# EasyEDA Pro project PCB工程源文件-RY-Serial.epro

# Schematic Schematic1
Create Date: 2024-03-03; Page Name: P1; Project Name: USB2Serial V1.0; Schematic Name: Schematic1; Update Date: 2024-03-04; Company: RYMCU; Page Size: A4; Version: V1.2
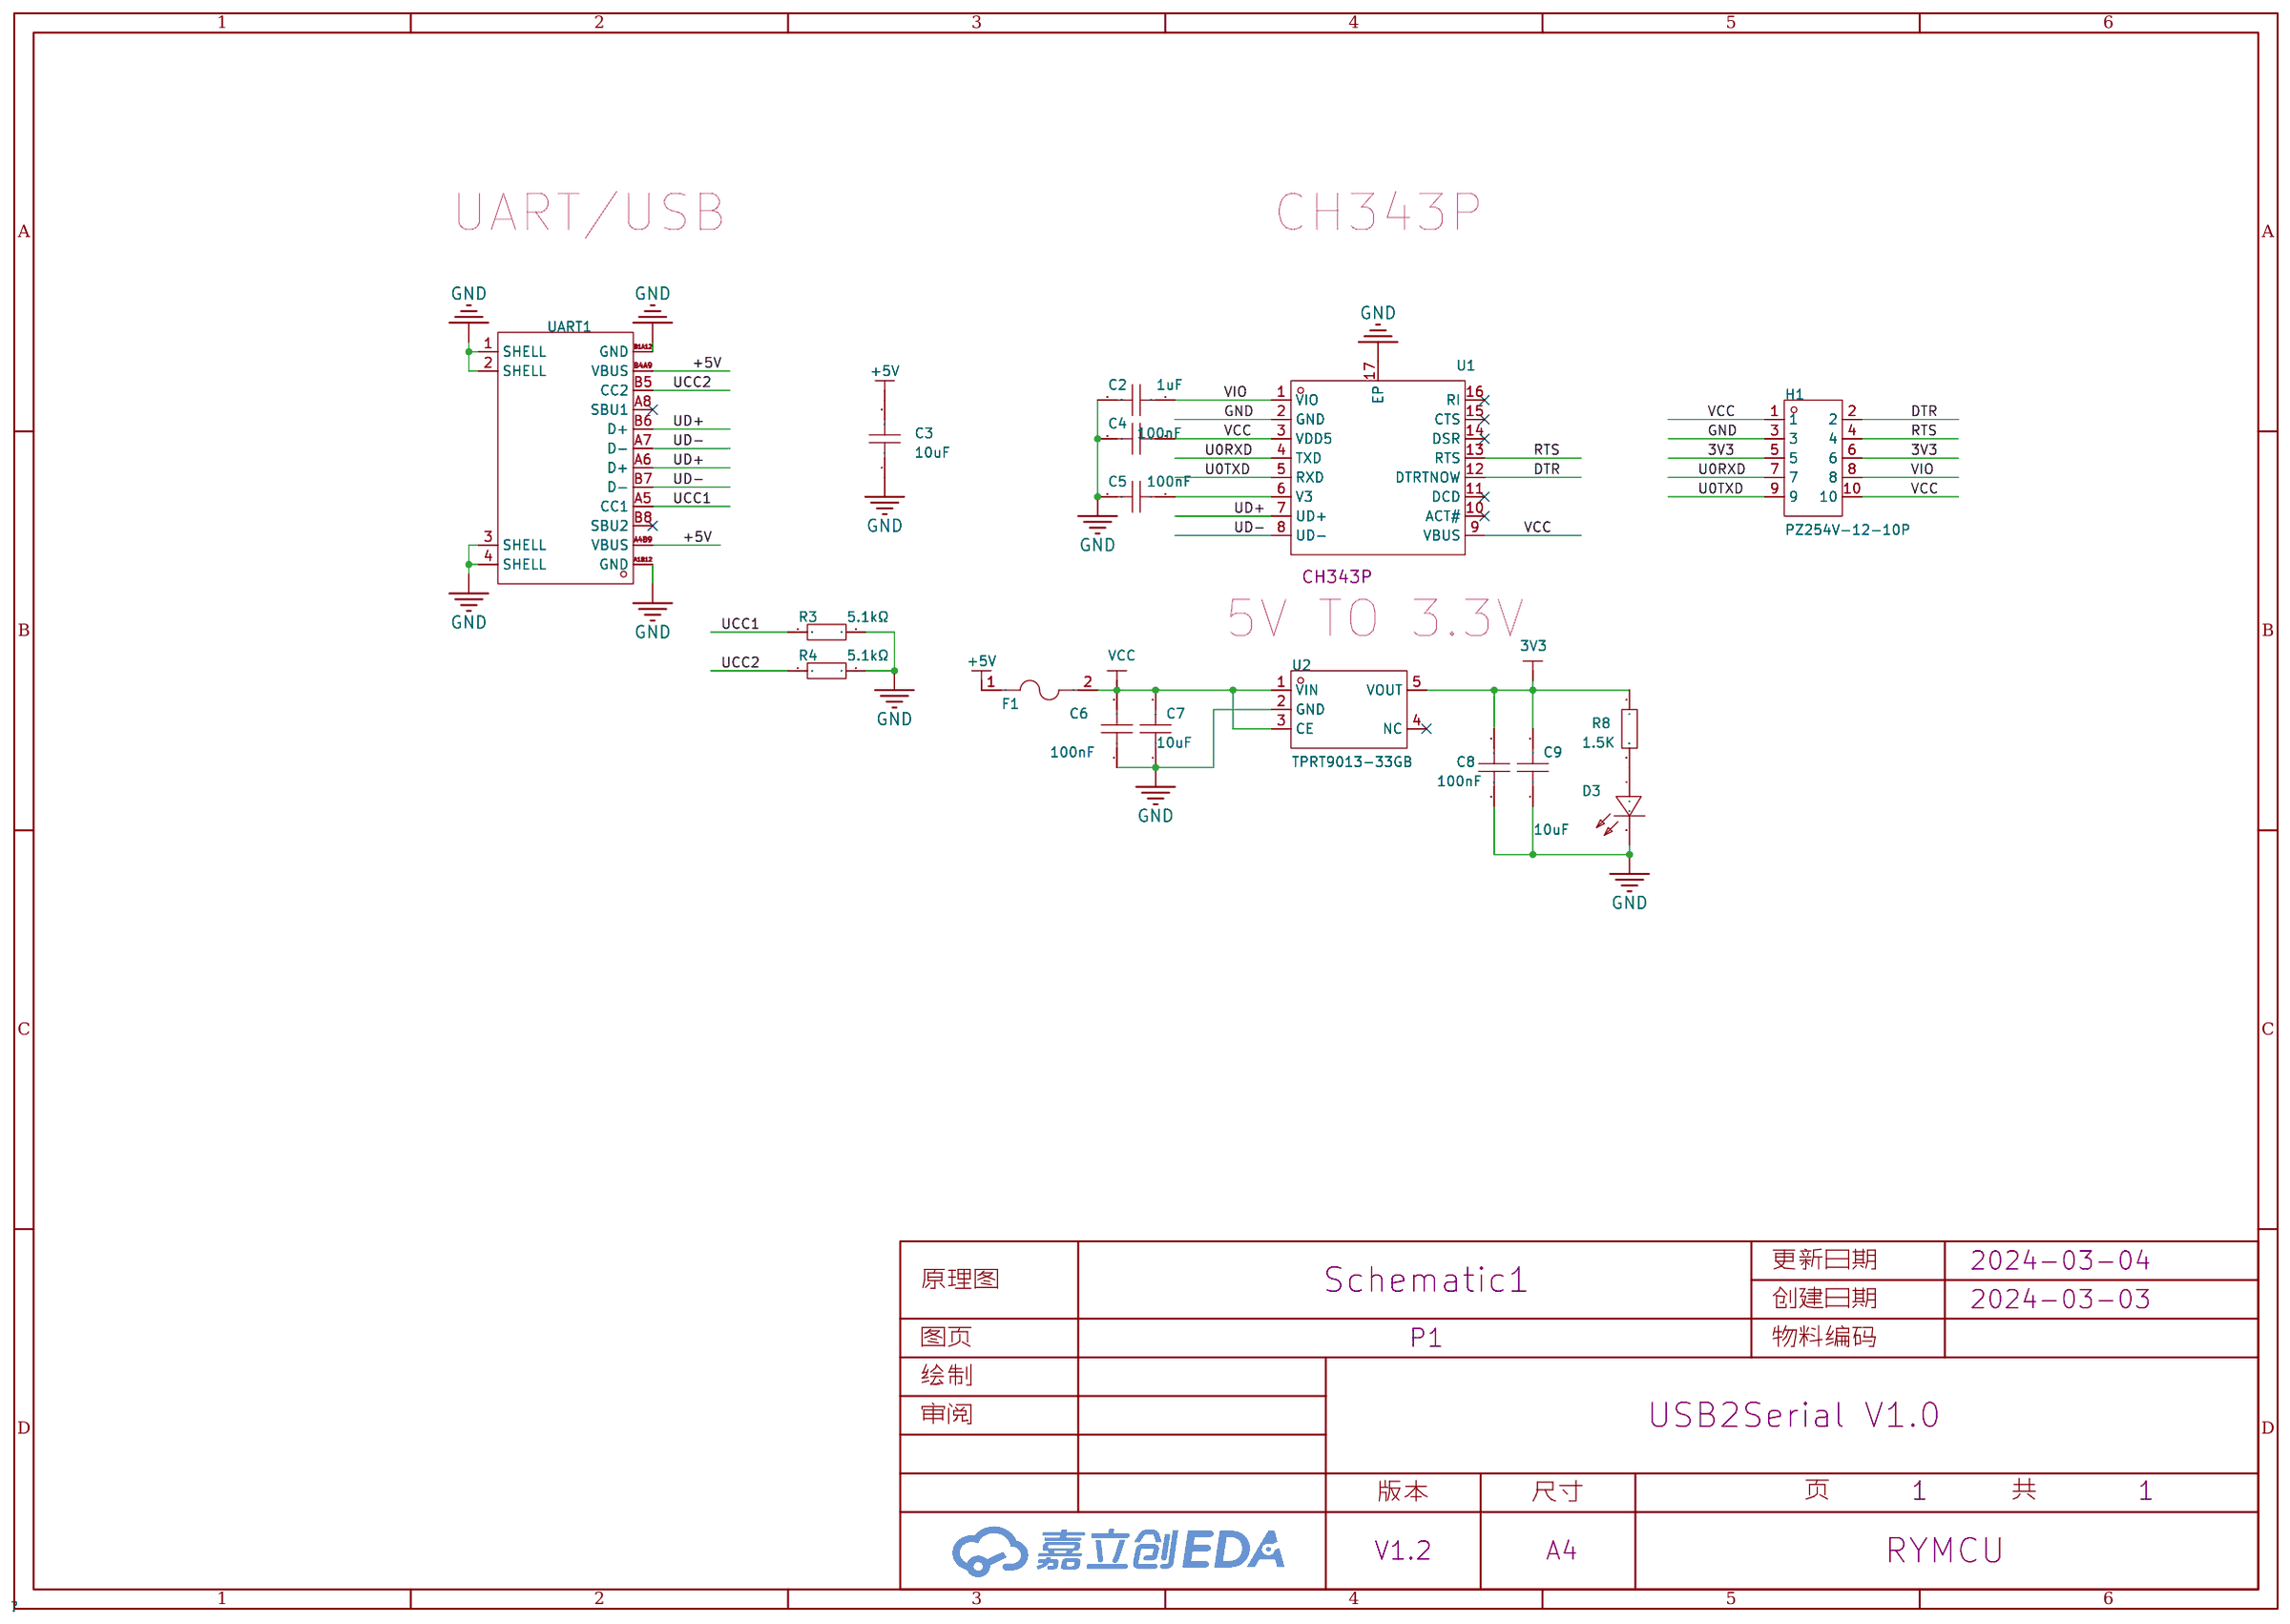
[diagram p0: schematic sheet]

## Parts
C2  1uF  [C0603]
C3  10uF  [C0805]
C4  100nF  [C0603]
C5  100nF  [C0603]
C6  100nF  [C0603]
C7  10uF  [C0805]
C8  100nF  [C0603]
C9  10uF  [C0805]
D3  NCD0603R3  [LED0603-R-RD_RED]
F1  -  [F0805]
H1  PZ254V-12-10P  [HDR-TH_10P-P2.54-V-M-R2-C5-S2.54]
R3  5.1kΩ  [R0603]
R4  5.1kΩ  [R0603]
R8  1.5K  [R0603]
U1  CH343P  [TQFN-16_L3.0-W3.0-P0.50-BL-EP1.7]
U2  TPRT9013-33GB  [SOT-23-5_L3.0-W1.7-P0.95-LS2.8-BL]
UART1  -  [USB-C-SMD_G-SWITCH_GT-USB-7010EN]

## Library data of the parts
C2 C4-C6 C8 = CC0603KRX7R9BB104: 容值:100nF;精度:±10%;额定电压:50V;材质(温度系数):X7R;; LCSC Part Name: 100nF ±10% 50V; Supplier Part: C14663; Manufacturer: YAGEO(国巨); Supplier Footprint: 0603; JLCPCB Part Class: Basic Part; Datasheet: https://atta.szlcsc.com/upload/public/pdf/source/20170116/1484561234239.pdf; Supplier: LCSC; Tolerance: ±10%; Voltage Rated: 50V; Temperature Coefficient: X7R
C3 C7 C9 = CC0805FRNPO9BN330: 容值:33pF;精度:±1pF;额定电压:50V;材质(温度系数):NP0;; LCSC Part Name: 33pF ±1pF 50V; Supplier Part: C541516; Manufacturer: YAGEO(国巨); Supplier Footprint: 0805; JLCPCB Part Class: Extended Part; Datasheet: https://atta.szlcsc.com/upload/public/pdf/source/20200615/C541516_87B4F5CEA473EFDDBB2B4786DAFFF3AA.pdf; Supplier: LCSC; Tolerance: ±1pF; Voltage Rated: 50V; Temperature Coefficient: NP0
D3 = NCD0603R3: 尺寸1.6x0.8x0.8；IF=20ma：1.6~2.6v，620~640nm,51~150mcd金线，光强高，功耗低，可靠性好，寿命长; LCSC Part Name: 红色;贴片LED;0603红灯;; Supplier Part: C3151730; Manufacturer: 国星光电; Supplier Footprint: 0603; JLCPCB Part Class: Extended Part; Datasheet: https://atta.szlcsc.com/upload/public/pdf/source/20220704/CBFF28C1847A97213A75929E60B7DDE7.pdf; Supplier: LCSC
F1 = ASMD0805-075: 最大电压:6V;最大电流:40A;保持电流:750mA;跳闸电流:1.5A;消耗功率:600mW;初始态阻值(最小值):90mΩ;跳断后阻值(最大值):385mΩ;最大动作时间:200ms;工作温度:-40~+85;; LCSC Part Name: 0.75A 自恢复; Supplier Part: C135330; Manufacturer: JDTfuse集电通; Supplier Footprint: 0805; JLCPCB Part Class: Extended Part; Datasheet: https://atta.szlcsc.com/upload/public/pdf/source/20171014/C135330_15079756464341038401.pdf; Supplier: LCSC; Operating Voltage (Max): 6V; Current Rating (Max): 40A; Hold Current: 750mA; Trip Current: 1.5A; Power Dissipation: 600mW; Resistance - Initial (Ri) (Min): 90mΩ; Resistance - Post Trip (R1) (Max): 385mΩ; Maximum Time to Trip: 200ms; Operating Temperature: -40~+85
H1 = PZ254V-12-10P: 插针结构:2x5P;间距:2.54mm;行距:2.54mm;圆针/方针:方针;安装类型:直插;排数:双排;总PIN位数:10P;额定电流:-;额定电压:-;配合针长度:6mm;塑高:2.5mm;端接针长度:3mm;触头材质:黄铜;触头镀层:-;工作温度范围:-40℃~+105℃;颜色:黑色;; LCSC Part Name: 间距:2.54mm 2x5P 直插 方针; Supplier Part: C492422; Manufacturer: XFCN(兴飞); Supplier Footprint: 插件,P=2.54mm; Datasheet: https://atta.szlcsc.com/upload/public/pdf/source/20200309/C492422_5020CEA01BE7051F9EA9DD81AB0A25E3.pdf; Supplier: LCSC; Pin Structure: 2x5P; Pitch: 2.54mm; Row Spacing: 2.54mm; Circluar Pins/Square Pins: 方针; Mounting Type: 直插; Number of Rows: 双排; Number of Pins: 10P; Length of Mating Pin: 6mm; Insulation Height: 2.5mm; Length of End Connection Pin: 3mm; Contact Material: 黄铜; Operating Temperature Range: -40℃~+105℃; Color: 黑色
R3 R4 = 0603WAF5101T5E: 阻值:5.1kΩ;精度:±1%;功率:100mW;温度系数:±100ppm/℃;电阻类型:厚膜电阻;; LCSC Part Name: 5.1kΩ ±1% 100mW 厚膜电阻; Supplier Part: C23186; Manufacturer: UNI-ROYAL(厚声); Supplier Footprint: 0603; JLCPCB Part Class: Basic Part; Datasheet: https://atta.szlcsc.com/upload/public/pdf/source/20200306/C422600_1E6D84923E4A46A82E41ADD87F860B5C.pdf; Supplier: LCSC; Tolerance: ±1%; Power(Watts): 100mW; Overload Voltage (Max): 75V; Temperature Coefficient: ±100ppm/℃; Type: 厚膜电阻; Operating Temperature Range: -55℃~+155℃
R8 = TR0603B10K0P0525Z: 电阻类型:薄膜电阻;阻值:10kΩ;精度:±0.1%;功率:100mW;温度系数:±25ppm/;最大工作电压:75V;工作温度范围:-55~+155;; LCSC Part Name: 10kΩ ±0.1% 100mW; Supplier Part: C188363; Manufacturer: EVER OHMS(天二科技); Supplier Footprint: 0603; JLCPCB Part Class: Extended Part; Datasheet: https://atta.szlcsc.com/upload/public/pdf/source/20190415/C188363_433BF05B6FB8F7A0F5F35A3E4390C55A.pdf; Supplier: LCSC; Type: 薄膜电阻; Tolerance: ±0.1%; Power(Watts): 100mW; Temperature Coefficient: ±25ppm/; Overload Voltage (Max): 75V; Operating Temperature Range: -55~+155
U1 = CH343P: 类型:-;协议类别:-;驱动器/接收器数:-;数据速率:-;; Supplier Part: C2846043; Manufacturer: WCH(南京沁恒); Supplier Footprint: QFN-16; JLCPCB Part Class: 扩展库; Datasheet: https://atta.szlcsc.com/upload/public/pdf/source/20211010/C2846043_7FA705E1F14A2906F6A2AFA45FA28209.pdf; Supplier: LCSC
U2 = TPRT9013-33GB: 输出类型:-;; Supplier Part: C587158; Manufacturer: TECH PUBLIC(台舟); Supplier Footprint: SOT-23-5; JLCPCB Part Class: 扩展库; Datasheet: https://atta.szlcsc.com/upload/public/pdf/source/20210810/692D4D0C3CF190F9330EFD28C3E572CB.pdf; Supplier: LCSC
UART1 = HC-TYPE-C-16P-01A-R: 连接器类型:Type-C;公母:母座;触点数量:16;端口数量:1;安装方式:卧贴;; LCSC Part Name: Type-C 母座 卧贴; Supplier Part: C2997433; Manufacturer: HCTL(华灿天禄); Supplier Footprint: SMD; Datasheet: https://atta.szlcsc.com/upload/public/pdf/source/20220415/23B51DCADC5F28223C40C3605487ACA1.pdf; Supplier: LCSC; Connector Type: Type-C; Gender: 母座; Number of Contacts: 16; Number of Ports: 1; Mounting Style: 卧贴

## Nets
3V3: C8.1 C9.2 H1.5 H1.6 R8.1 U2.5(VOUT)
+5V: C3.2 F1.1 UART1.A4B9(VBUS) UART1.B4A9(VBUS)
GND: C2.2 C3.1 C4.2 C5.2 C6.1 C7.1 C8.2 C9.1 D3.2(K) H1.3 R3.2 R4.2 U1.2(GND) U1.17(EP) U2.2(GND) UART1.1(SHELL) UART1.2(SHELL) UART1.3(SHELL) UART1.4(SHELL) UART1.A1B12(GND) UART1.B1A12(GND)
VCC: C4.1 C6.2 C7.2 F1.2 H1.1 H1.10 U1.3(VDD5) U1.9(VBUS) U2.1(VIN) U2.3(CE)
DTR: H1.2 U1.12(DTRTNOW)
RTS: H1.4 U1.13(RTS)
U0RXD: H1.7 U1.4(TXD)
U0TXD: H1.9 U1.5(RXD)
UCC1: R3.1 UART1.A5(CC1)
UCC2: R4.1 UART1.B5(CC2)
UD+: U1.7(UD+) UART1.A6(D+) UART1.B6(D+)
UD-: U1.8(UD-) UART1.A7(D-) UART1.B7(D-)
VIO: C2.1 H1.8 U1.1(VIO)
$1N1274: C5.1 U1.6(V3)
$1N1329: D3.1(A) R8.2

Not connected (* = marked no-connect by the designer): U1 10(ACT#)* 11(DCD)* 14(DSR)* 15(CTS)* 16(RI)*; U2 4(NC)*; UART1 A8(SBU1)* B8(SBU2)*

## Notes on the sheet
- UART/USB
- CH343P
- 5V TO 3.3V

# Board PCB2
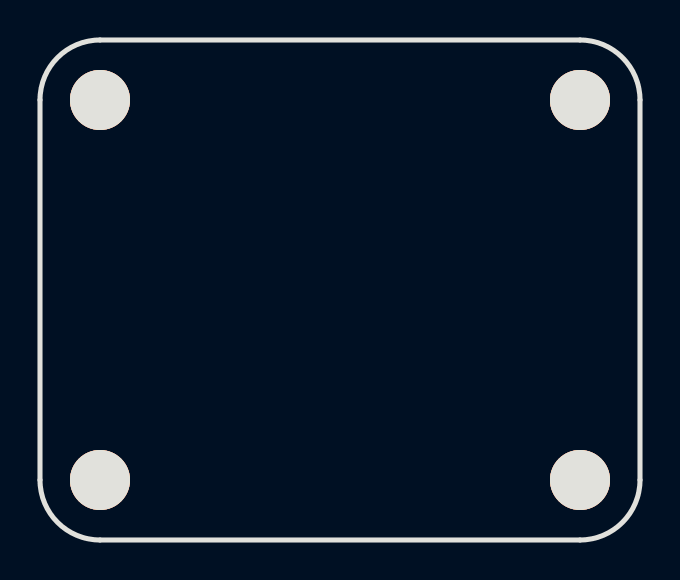
[diagram p1: board, top side]
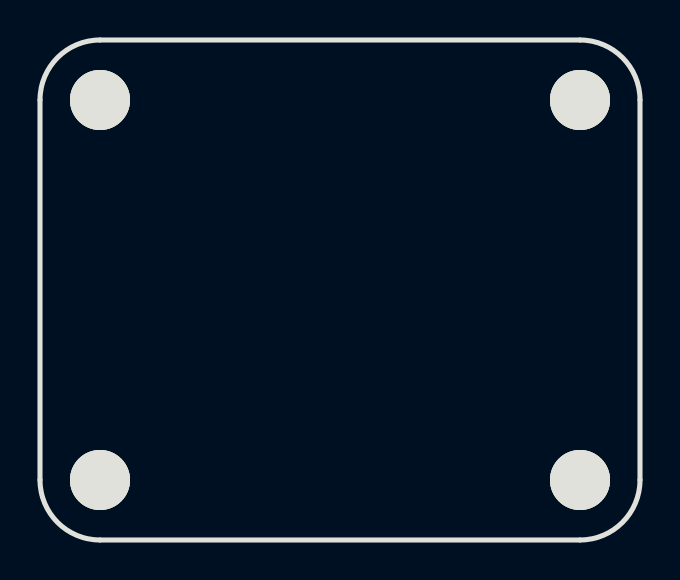
[diagram p2: board, bottom side, seen from below]

Outline 30 x 25 mm; copper layers: Top Layer, Bottom Layer. Coordinates in mm from the lower left corner of the outline.
Outline path: 0,22 arc(0.88,24.12) 3,25 27,25 arc(29.12,24.12) 30,22 30,3 arc(29.12,0.88) 27,0 3,0 arc(0.88,0.88) 0,3 0,22
Stack: Top Layer 0.035mm / Dielectric1 1.51mm FR4 er 4.5 / Bottom Layer 0.035mm

## Design rules (mm)
template: JLCPCB Capability(Two Layers Board)
spacing copperThickness1oz (default): track to track 0.102, other pairs 0.152 to 0.3
spacing copperThickness2oz: track to track 0.203, other pairs 0.152 to 0.3
track width copperThickness1oz (default): min 0.127, default 0.254, max 2.54
track width copperThickness2oz: min 0.203, default 0.254, max 2.54
differential pair differentialPair (default): width min 0.127, default 0.254, max 2.54; gap min 0.152, default 0.152
via viaSize (default): diameter min 0.5, default 0.61, max 10; hole min 0.3, default 0.305, max 6.3

## Placement (name value [footprint] x y rotation side)
NOREF  -  [Pad_e13]  27 3 270 top
NOREF#2  -  [Pad_e17]  3 3 270 top
NOREF#3  -  [Pad_e7]  3 22 270 top
NOREF#4  -  [Pad_e11]  27 22 270 top

## Footprints (pads in the part's own frame, mm; a bottom-side part is the same pattern mirrored in y, then rotated)
Pad_e7
  round 3 hole 3: N(0,0)
Pad_e11
  round 3 hole 3: N(0,0)
Pad_e13
  round 3 hole 3: N(0,0)
Pad_e17
  round 3 hole 3: N(0,0)

## Nets

Pads without a net: NOREF N; NOREF#2 N; NOREF#3 N; NOREF#4 N

# Board PCB1
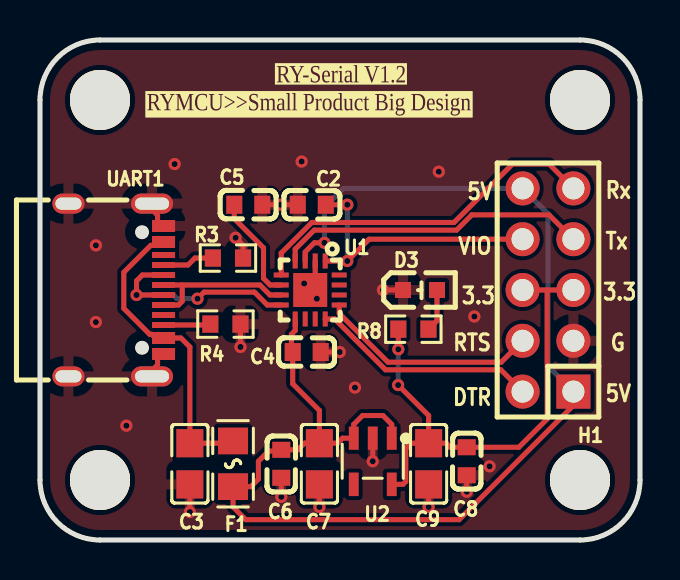
[diagram p3: board, top side]
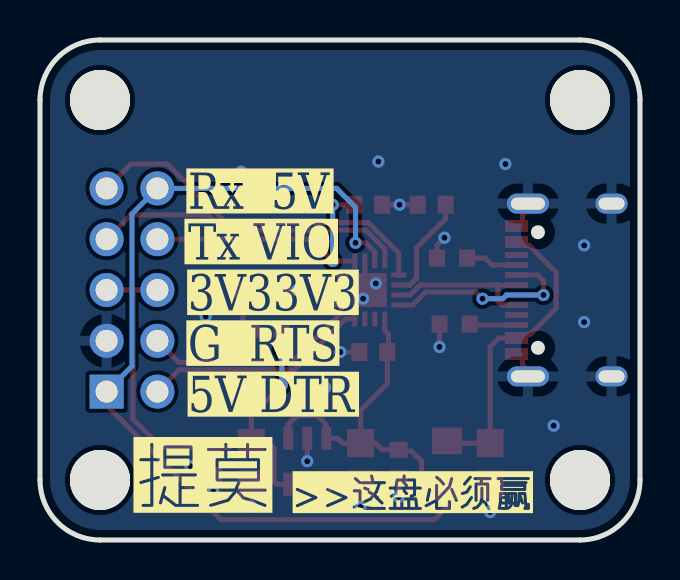
[diagram p4: board, bottom side, seen from below]

Outline 30 x 25 mm; copper layers: Top Layer, Bottom Layer. Coordinates in mm from the lower left corner of the outline.
Outline path: 0,22 arc(0.88,24.12) 3,25 27,25 arc(29.12,24.12) 30,22 30,3 arc(29.12,0.88) 27,0 3,0 arc(0.88,0.88) 0,3 0,22
Stack: Top Layer 0.035mm / Dielectric1 1.51mm FR4 er 4.5 / Bottom Layer 0.035mm

## Design rules (mm)
template: JLCPCB Capability(Two Layers Board)
spacing copperThickness1oz (default): track to track 0.102, other pairs 0.152 to 0.3
spacing copperThickness2oz: track to track 0.203, other pairs 0.152 to 0.3
track width copperThickness1oz (default): min 0.127, default 0.254, max 2.54
track width copperThickness2oz: min 0.203, default 0.254, max 2.54
differential pair differentialPair (default): width min 0.127, default 0.254, max 2.54; gap min 0.152, default 0.152
via viaSize (default): diameter min 0.5, default 0.61, max 10; hole min 0.3, default 0.305, max 6.3

## Placement (name value [footprint] x y rotation side)
C2  1uF  [C0603]  13.59 16.76 180 top
C3  10uF  [C0805]  7.49 3.81 90 top
C4  100nF  [C0603]  13.34 9.4 0 top
C5  100nF  [C0603]  10.41 16.76 0 top
C6  100nF  [C0603]  12.06 3.81 90 top
C7  10uF  [C0805]  13.97 3.81 90 top
C8  100nF  [C0603]  21.34 3.94 270 top
C9  10uF  [C0805]  19.43 3.81 90 top
D3  NCD0603R3  [LED0603-R-RD_RED]  19 12.5 0 top
F1  -  [F0805]  9.65 3.81 270 top
H1  PZ254V-12-10P  [HDR-TH_10P-P2.54-V-M-R2-C5-S2.54]  25.4 12.5 90 top
NOREF  -  [Pad_e3]  3 3 270 top
NOREF#2  -  [Pad_e15]  27 22 270 top
NOREF#3  -  [Pad_e16]  3 22 270 top
NOREF#4  -  [Pad_e4]  27 3 270 top
R3  5.1kΩ  [R0603]  9.4 14.1 0 top
R4  5.1kΩ  [R0603]  9.27 10.8 0 top
R8  1.5K  [R0603]  18.67 10.54 0 top
U1  CH343P  [TQFN-16_L3.0-W3.0-P0.50-BL-EP1.7]  13.51 12.5 180 top
U2  TPRT9013-33GB  [SOT-23-5_L3.0-W1.7-P0.95-LS2.8-BL]  16.64 3.94 180 top
UART1  -  [USB-C-SMD_G-SWITCH_GT-USB-7010EN]  3.8 12.5 270 top

## Footprints (pads in the part's own frame, mm; a bottom-side part is the same pattern mirrored in y, then rotated)
C0603
  rect 0.8x0.9 smd: 1(-0.7,0) 2(0.7,0)
C0805
  rect 1.41x1.35 smd: 1(-1.03,0) 2(1.03,0)
F0805
  rect 1.335x1.5 smd: 1(-1.143,0) 2(1.143,0)
HDR-TH_10P-P2.54-V-M-R2-C5-S2.54
  rect 1.7x1.7 hole 1.1: 1(-5.08,-1.27)
  round 1.7 hole 1.1: 2(-5.08,1.27) 3(-2.54,-1.27) 4(-2.54,1.27) 5(0,-1.27) 6(0,1.27) 7(2.54,-1.27) 8(2.54,1.27) 9(5.08,-1.27) 10(5.08,1.27)
LED0603-R-RD_RED
  rect 0.8x0.8 smd: 1(0.851,0) 2(-0.851,0)
Pad_e3
  round 3 hole 3: N(0,0)
Pad_e4
  round 3 hole 3: N(0,0)
Pad_e15
  round 3 hole 3: N(0,0)
Pad_e16
  round 3 hole 3: N(0,0)
R0603
  rect 0.806x0.864 smd: 1(-0.753,0) 2(0.753,0)
SOT-23-5_L3.0-W1.7-P0.95-LS2.8-BL
  rect 0.49x1.157 smd: 1(-0.95,-1.153) 2(0,-1.153) 3(0.95,-1.153)
  rect 0.49x1.175 smd: 4(0.95,1.153) 5(-0.95,1.153)
TQFN-16_L3.0-W3.0-P0.50-BL-EP1.7
  rect 0.25x0.75 smd: 1(-0.749,-1.45) 2(-0.248,-1.45) 3(0.252,-1.45) 4(0.751,-1.45) 9(0.75,1.45) 10(0.25,1.45) 11(-0.25,1.45) 12(-0.749,1.45)
  rect 0.75x0.25 smd: 5(1.45,-0.75) 6(1.45,-0.25) 7(1.45,0.25) 8(1.45,0.75) 13(-1.45,0.75) 14(-1.45,0.25) 15(-1.45,-0.25) 16(-1.45,-0.75)
  rect 1.7x1.7 smd: 17(0.001,0)
USB-C-SMD_G-SWITCH_GT-USB-7010EN
  oval 1x2.1 hole 0.6x1.7: 1(-4.32,1.802) 2(4.32,1.802)
  oval 1x1.6 hole 0.6x1.3: 3(4.32,-2.377) 4(-4.32,-2.377)
  rect 0.6x1.15 smd: A1B12(-3.2,2.377) A4B9(-2.4,2.377) B1A12(3.2,2.377) B4A9(2.4,2.377)
  rect 0.3x1.15 smd: A5(-1.25,2.377) A6(-0.25,2.377) A7(0.25,2.377) A8(1.25,2.377) B5(1.75,2.377) B6(0.75,2.377) B7(-0.75,2.377) B8(-1.75,2.377)

## Nets
As in the schematic.

Pads without a net: NOREF N; NOREF#2 N; NOREF#3 N; NOREF#4 N; U1 10 11 14 15 16; U2 4; UART1 A8 B8

## Via types
v1: diameter 0.61, hole 0.305, Top Layer to Bottom Layer, 29 vias

## Routing (per net, layer and track width the routed paths; a pad name or vN(x,y) marks a point on that pad's centre or on a via; arc(x,y) is an arc through that point)
3V3: length 25.6
  Top Layer w0.254: C9.2 18.56,4.84 18.29,4.57 18.29,2.92 18.15,2.78 U2.5 ; C9.2 19.43,6.22 v1(17.91,7.75) ; C9.2 20.31,4.84 20.51,4.64 C8.1 23.94,4.64 25.36,6.05 25.36,12.5 ; R8.1 v1(17.92,9.53) ; 25.36,12.5 H1.6 ; 25.36,12.5 H1.5
  Bottom Layer w0.254: v1(17.91,7.75) 17.91,9.53 v1(17.92,9.53)
+5V: length 15.2
  Top Layer w0.254: 5.88,14.89 5.72,14.73 5.54,14.73 4.19,13.39 4.19,11.58 5.48,10.29 5.59,10.29 5.78,10.1 7.05,10.1 7.49,9.65 C3.2 9.54,4.84 F1.1
GND: length 16.9
  Top Layer w0.254: U2.2 v1(16.64,3.94) ; C9.1 v1(19.43,1.65) ; C6.1 v1(12.06,2.16) ; D3.2 v1(17.15,12.5) ; 5.88,15.7 5.88,16.25 5.3,16.82 ; U1.17 13.76,12.75 U1.2 ; C5.2 v1(12.02,16.76) C2.2 ; C3.1 v1(7.49,1.4) ; 5.3,8.18 5.88,8.76 5.88,9.3 ; R3.2 10.15,14.74 v1(9.78,15.11) ; C4.2 v1(14.99,9.4) ; 21.34,3.24 v1(21.34,2.41) ; R4.2 v1(10.02,9.65) ; C7.1 v1(13.97,1.65)
  vias: v1(2.79,14.73) v1(2.79,10.9) v1(4.32,5.72) v1(6.73,18.8) v1(13.08,18.92) v1(13.21,12.83) v1(13.84,12.06) v1(15.75,7.62) v1(19.94,18.42) v1(21.72,11.18) v1(22.48,3.68)
VCC: length 64.3
  Top Layer w0.254: H1.1 26.67,6.73 20.96,1.02 10.29,1.02 9.65,1.65 F1.2 10.54,2.67 10.92,3.05 10.92,3.94 11.43,4.45 12,4.45 C6.2 12.89,4.51 13.22,4.84 C7.2 ; U2.1 17.59,5.78 17.15,6.22 16.13,6.22 15.69,5.78 U2.3 15.12,5.09 14.87,4.84 C7.2 ; U1.9 12.76,10.48 12.57,10.29 12.57,9.46 C4.1 12.64,7.81 13.97,6.48 C7.2 ; U1.3 13.26,14.4 13.72,14.86 v1(14.22,14.86)
  Bottom Layer w0.254: H1.1 25.4,8.69 25.4,16.31 H1.10 15.17,17.58 14.22,16.64 v1(14.22,14.86)
DTR: length 11.4
  Top Layer w0.254: U1.12 14.74,11.05 17.28,8.51 23.04,8.51 H1.2
RTS: length 11
  Top Layer w0.254: H1.4 23.06,8.89 17.4,8.89 14.96,11.33 U1.13
U0RXD: length 15.7
  Top Layer w0.254: H1.7 25.45,16.26 21.59,16.26 20.83,15.49 13.71,15.49 12.76,14.54 U1.4
U0TXD: length 18.1
  Top Layer w0.254: H1.9 25.45,18.8 23.62,18.8 20.7,15.88 13.59,15.88 12.06,14.35 U1.5
UCC1: length 2.9
  Top Layer w0.254: R3.1 7.75,14.1 7.4,13.75 5.88,13.75
UCC2: length 2.7
  Top Layer w0.254: R4.1 8.47,10.75 5.88,10.75
UD+: length 8.5
  Top Layer w0.254: 7.11,12.75 11,12.75 11.5,12.25 U1.7 ; 7.11,12.75 5.88,12.75 ; 7.11,12.75 7.11,11.94 6.92,11.75 5.88,11.75
UD-: length 11.2
  Top Layer w0.254: UART1.B7 5.12,13.25 4.83,12.95 v1(4.83,12.25) UART1.A7 ; U1.8 11.36,11.75 10.72,12.39 8.2,12.39 v1(7.87,12.06)
  Bottom Layer w0.254: v1(7.87,12.06) 6.86,12.06 6.67,12.25 v1(4.83,12.25)
VIO: length 14.2
  Top Layer w0.254: H1.8 16.45,15.04 v1(15.36,13.95) U1.1 ; C2.1 v1(15.37,16.76)
  Bottom Layer w0.254: v1(15.36,13.95) 15.37,13.95 v1(15.37,16.76)
$1N1274: length 5.3
  Top Layer w0.254: U1.6 11.51,12.75 11.18,13.08 11.18,14.61 9.71,16.07 9.71,16.76
$1N1329: length 2.1
  Top Layer w0.254: R8.2 19.85,10.97 D3.1

## Copper pours and planes (outline as drawn; the poured copper is in the pictures)
GND on Top Layer: 0,25.08 29.97,25.08 29.97,-0.19 0,-0.19
GND on Bottom Layer: 0,25.27 29.97,25.27 29.97,0 0,0

## Text on the board
Bottom Silkscreen Layer: Rx  5V | Tx VIO | 3V33V3 | G  RTS | 5V DTR | 提莫 | >>这盘必须赢
Top Silkscreen Layer: DTR | RTS | VIO | 3.3 | 5V | Rx | Tx | G | RYMCU>>Small Product Big Design | RY-Serial V1.2

# Board PCB1_1
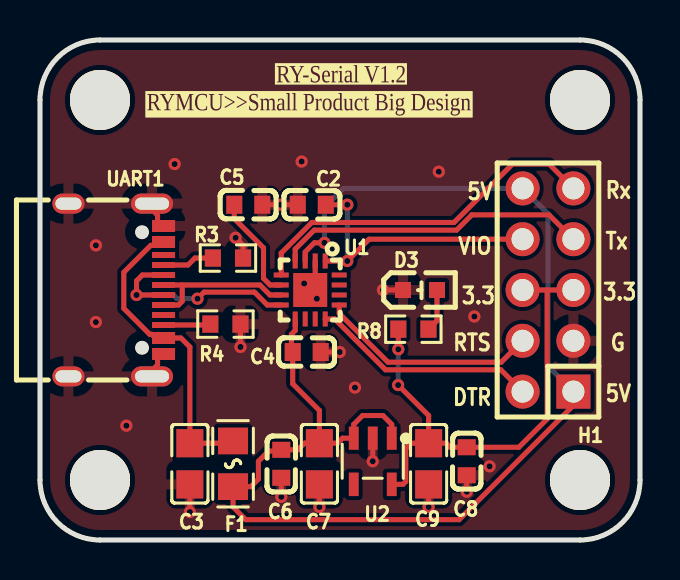
[diagram p5: board, top side]
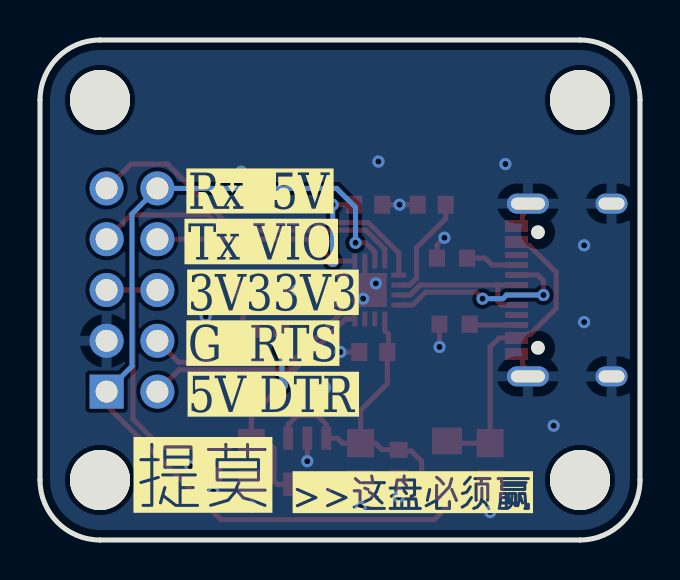
[diagram p6: board, bottom side, seen from below]

Outline 30 x 25 mm; copper layers: Top Layer, Bottom Layer. Coordinates in mm from the lower left corner of the outline.
Outline path: 0,22 arc(0.88,24.12) 3,25 27,25 arc(29.12,24.12) 30,22 30,3 arc(29.12,0.88) 27,0 3,0 arc(0.88,0.88) 0,3 0,22
Stack: Top Layer 0.035mm / Dielectric1 1.51mm FR4 er 4.5 / Bottom Layer 0.035mm

## Design rules (mm)
template: JLCPCB Capability(Two Layers Board)
spacing copperThickness1oz (default): track to track 0.102, other pairs 0.152 to 0.3
spacing copperThickness2oz: track to track 0.203, other pairs 0.152 to 0.3
track width copperThickness1oz (default): min 0.127, default 0.254, max 2.54
track width copperThickness2oz: min 0.203, default 0.254, max 2.54
differential pair differentialPair (default): width min 0.127, default 0.254, max 2.54; gap min 0.152, default 0.152
via viaSize (default): diameter min 0.5, default 0.61, max 10; hole min 0.3, default 0.305, max 6.3

## Placement (name value [footprint] x y rotation side)
C2  1uF  [C0603]  13.59 16.76 180 top
C3  10uF  [C0805]  7.49 3.81 90 top
C4  100nF  [C0603]  13.34 9.4 0 top
C5  100nF  [C0603]  10.41 16.76 0 top
C6  100nF  [C0603]  12.06 3.81 90 top
C7  10uF  [C0805]  13.97 3.81 90 top
C8  100nF  [C0603]  21.34 3.94 270 top
C9  10uF  [C0805]  19.43 3.81 90 top
D3  NCD0603R3  [LED0603-R-RD_RED]  19 12.5 0 top
F1  -  [F0805]  9.65 3.81 270 top
H1  PZ254V-12-10P  [HDR-TH_10P-P2.54-V-M-R2-C5-S2.54]  25.4 12.5 90 top
NOREF  -  [Pad_e15]  27 22 270 top
NOREF#2  -  [Pad_e4]  27 3 270 top
NOREF#3  -  [Pad_e16]  3 22 270 top
NOREF#4  -  [Pad_e3]  3 3 270 top
R3  5.1kΩ  [R0603]  9.4 14.1 0 top
R4  5.1kΩ  [R0603]  9.27 10.8 0 top
R8  1.5K  [R0603]  18.67 10.54 0 top
U1  CH343P  [TQFN-16_L3.0-W3.0-P0.50-BL-EP1.7]  13.51 12.5 180 top
U2  TPRT9013-33GB  [SOT-23-5_L3.0-W1.7-P0.95-LS2.8-BL]  16.64 3.94 180 top
UART1  -  [USB-C-SMD_G-SWITCH_GT-USB-7010EN]  3.8 12.5 270 top

## Footprints (pads in the part's own frame, mm; a bottom-side part is the same pattern mirrored in y, then rotated)
C0603
  rect 0.8x0.9 smd: 1(-0.7,0) 2(0.7,0)
C0805
  rect 1.41x1.35 smd: 1(-1.03,0) 2(1.03,0)
F0805
  rect 1.335x1.5 smd: 1(-1.143,0) 2(1.143,0)
HDR-TH_10P-P2.54-V-M-R2-C5-S2.54
  rect 1.7x1.7 hole 1.1: 1(-5.08,-1.27)
  round 1.7 hole 1.1: 2(-5.08,1.27) 3(-2.54,-1.27) 4(-2.54,1.27) 5(0,-1.27) 6(0,1.27) 7(2.54,-1.27) 8(2.54,1.27) 9(5.08,-1.27) 10(5.08,1.27)
LED0603-R-RD_RED
  rect 0.8x0.8 smd: 1(0.851,0) 2(-0.851,0)
Pad_e3
  round 3 hole 3: N(0,0)
Pad_e4
  round 3 hole 3: N(0,0)
Pad_e15
  round 3 hole 3: N(0,0)
Pad_e16
  round 3 hole 3: N(0,0)
R0603
  rect 0.806x0.864 smd: 1(-0.753,0) 2(0.753,0)
SOT-23-5_L3.0-W1.7-P0.95-LS2.8-BL
  rect 0.49x1.157 smd: 1(-0.95,-1.153) 2(0,-1.153) 3(0.95,-1.153)
  rect 0.49x1.175 smd: 4(0.95,1.153) 5(-0.95,1.153)
TQFN-16_L3.0-W3.0-P0.50-BL-EP1.7
  rect 0.25x0.75 smd: 1(-0.749,-1.45) 2(-0.248,-1.45) 3(0.252,-1.45) 4(0.751,-1.45) 9(0.75,1.45) 10(0.25,1.45) 11(-0.25,1.45) 12(-0.749,1.45)
  rect 0.75x0.25 smd: 5(1.45,-0.75) 6(1.45,-0.25) 7(1.45,0.25) 8(1.45,0.75) 13(-1.45,0.75) 14(-1.45,0.25) 15(-1.45,-0.25) 16(-1.45,-0.75)
  rect 1.7x1.7 smd: 17(0.001,0)
USB-C-SMD_G-SWITCH_GT-USB-7010EN
  oval 1x2.1 hole 0.6x1.7: 1(-4.32,1.802) 2(4.32,1.802)
  oval 1x1.6 hole 0.6x1.3: 3(4.32,-2.377) 4(-4.32,-2.377)
  rect 0.6x1.15 smd: A1B12(-3.2,2.377) A4B9(-2.4,2.377) B1A12(3.2,2.377) B4A9(2.4,2.377)
  rect 0.3x1.15 smd: A5(-1.25,2.377) A6(-0.25,2.377) A7(0.25,2.377) A8(1.25,2.377) B5(1.75,2.377) B6(0.75,2.377) B7(-0.75,2.377) B8(-1.75,2.377)

## Nets
3V3: C8.1 C9.2 H1.5 H1.6 R8.1 U2.5
+5V: C3.2 F1.1 UART1.A4B9 UART1.B4A9
GND: C2.2 C3.1 C4.2 C5.2 C6.1 C7.1 C8.2 C9.1 D3.2 H1.3 R3.2 R4.2 U1.2 U1.17 U2.2 UART1.1 UART1.2 UART1.3 UART1.4 UART1.A1B12 UART1.B1A12
VCC: C4.1 C6.2 C7.2 F1.2 H1.1 H1.10 U1.3 U1.9 U2.1 U2.3
DTR: H1.2 U1.12
RTS: H1.4 U1.13
U0RXD: H1.7 U1.4
U0TXD: H1.9 U1.5
UCC1: R3.1 UART1.A5
UCC2: R4.1 UART1.B5
UD+: U1.7 UART1.A6 UART1.B6
UD-: U1.8 UART1.A7 UART1.B7
VIO: C2.1 H1.8 U1.1
$1N1274: C5.1 U1.6
$1N1329: D3.1 R8.2

Pads without a net: NOREF N; NOREF#2 N; NOREF#3 N; NOREF#4 N; U1 10 11 14 15 16; U2 4; UART1 A8 B8

## Via types
v1: diameter 0.61, hole 0.305, Top Layer to Bottom Layer, 29 vias

## Routing (per net, layer and track width the routed paths; a pad name or vN(x,y) marks a point on that pad's centre or on a via; arc(x,y) is an arc through that point)
3V3: length 25.6
  Top Layer w0.254: C9.2 19.43,6.22 v1(17.91,7.75) ; C9.2 18.56,4.84 18.29,4.57 18.29,2.92 18.15,2.78 U2.5 ; C9.2 20.31,4.84 20.51,4.64 C8.1 23.94,4.64 25.36,6.05 25.36,12.5 ; H1.5 25.36,12.5 ; 25.36,12.5 H1.6 ; R8.1 v1(17.92,9.53)
  Bottom Layer w0.254: v1(17.92,9.53) 17.91,9.53 v1(17.91,7.75)
+5V: length 15.2
  Top Layer w0.254: F1.1 9.54,4.84 C3.2 7.49,9.65 7.05,10.1 5.78,10.1 5.59,10.29 5.48,10.29 4.19,11.58 4.19,13.39 5.54,14.73 5.72,14.73 5.88,14.89
GND: length 16.9
  Top Layer w0.254: U2.2 v1(16.64,3.94) ; C9.1 v1(19.43,1.65) ; 5.3,8.18 5.88,8.76 5.88,9.3 ; C3.1 v1(7.49,1.4) ; C6.1 v1(12.06,2.16) ; U1.17 13.76,12.75 U1.2 ; C7.1 v1(13.97,1.65) ; v1(9.78,15.11) 10.15,14.74 R3.2 ; 21.34,3.24 v1(21.34,2.41) ; D3.2 v1(17.15,12.5) ; 5.88,15.7 5.88,16.25 5.3,16.82 ; C4.2 v1(14.99,9.4) ; R4.2 v1(10.02,9.65) ; C2.2 v1(12.02,16.76) C5.2
  vias: v1(2.79,14.73) v1(2.79,10.9) v1(4.32,5.72) v1(6.73,18.8) v1(13.08,18.92) v1(13.21,12.83) v1(13.84,12.06) v1(15.75,7.62) v1(19.94,18.42) v1(21.72,11.18) v1(22.48,3.68)
VCC: length 64.3
  Top Layer w0.254: U2.1 17.59,5.78 17.15,6.22 16.13,6.22 15.69,5.78 U2.3 15.12,5.09 14.87,4.84 C7.2 ; v1(14.22,14.86) 13.72,14.86 13.26,14.4 U1.3 ; C7.2 13.22,4.84 12.89,4.51 C6.2 12,4.45 11.43,4.45 10.92,3.94 10.92,3.05 10.54,2.67 F1.2 9.65,1.65 10.29,1.02 20.96,1.02 26.67,6.73 H1.1 ; C7.2 13.97,6.48 12.64,7.81 C4.1 12.57,9.46 12.57,10.29 12.76,10.48 U1.9
  Bottom Layer w0.254: H1.1 25.4,8.69 25.4,16.31 H1.10 15.17,17.58 14.22,16.64 v1(14.22,14.86)
DTR: length 11.4
  Top Layer w0.254: H1.2 23.04,8.51 17.28,8.51 14.74,11.05 U1.12
RTS: length 11
  Top Layer w0.254: H1.4 23.06,8.89 17.4,8.89 14.96,11.33 U1.13
U0RXD: length 15.7
  Top Layer w0.254: H1.7 25.45,16.26 21.59,16.26 20.83,15.49 13.71,15.49 12.76,14.54 U1.4
U0TXD: length 18.1
  Top Layer w0.254: H1.9 25.45,18.8 23.62,18.8 20.7,15.88 13.59,15.88 12.06,14.35 U1.5
UCC1: length 2.9
  Top Layer w0.254: 5.88,13.75 7.4,13.75 7.75,14.1 R3.1
UCC2: length 2.7
  Top Layer w0.254: R4.1 8.47,10.75 5.88,10.75
UD+: length 8.5
  Top Layer w0.254: 7.11,12.75 7.11,11.94 6.92,11.75 5.88,11.75 ; 7.11,12.75 5.88,12.75 ; 7.11,12.75 11,12.75 11.5,12.25 U1.7
UD-: length 11.2
  Top Layer w0.254: v1(7.87,12.06) 8.2,12.39 10.72,12.39 11.36,11.75 U1.8 ; UART1.B7 5.12,13.25 4.83,12.95 v1(4.83,12.25) UART1.A7
  Bottom Layer w0.254: v1(7.87,12.06) 6.86,12.06 6.67,12.25 v1(4.83,12.25)
VIO: length 14.2
  Top Layer w0.254: C2.1 v1(15.37,16.76) ; H1.8 16.45,15.04 v1(15.36,13.95) U1.1
  Bottom Layer w0.254: v1(15.37,16.76) 15.37,13.95 v1(15.36,13.95)
$1N1274: length 5.3
  Top Layer w0.254: 9.71,16.76 9.71,16.07 11.18,14.61 11.18,13.08 11.51,12.75 U1.6
$1N1329: length 2.1
  Top Layer w0.254: D3.1 19.85,10.97 R8.2

## Copper pours and planes (outline as drawn; the poured copper is in the pictures)
GND on Top Layer: 0,25.08 29.97,25.08 29.97,-0.19 0,-0.19
GND on Bottom Layer: 0,25.27 29.97,25.27 29.97,0 0,0

## Text on the board
Bottom Silkscreen Layer: Rx  5V | Tx VIO | 3V33V3 | G  RTS | 5V DTR | 提莫 | >>这盘必须赢
Top Silkscreen Layer: DTR | RTS | VIO | 3.3 | 5V | Rx | Tx | G | RYMCU>>Small Product Big Design | RY-Serial V1.2
